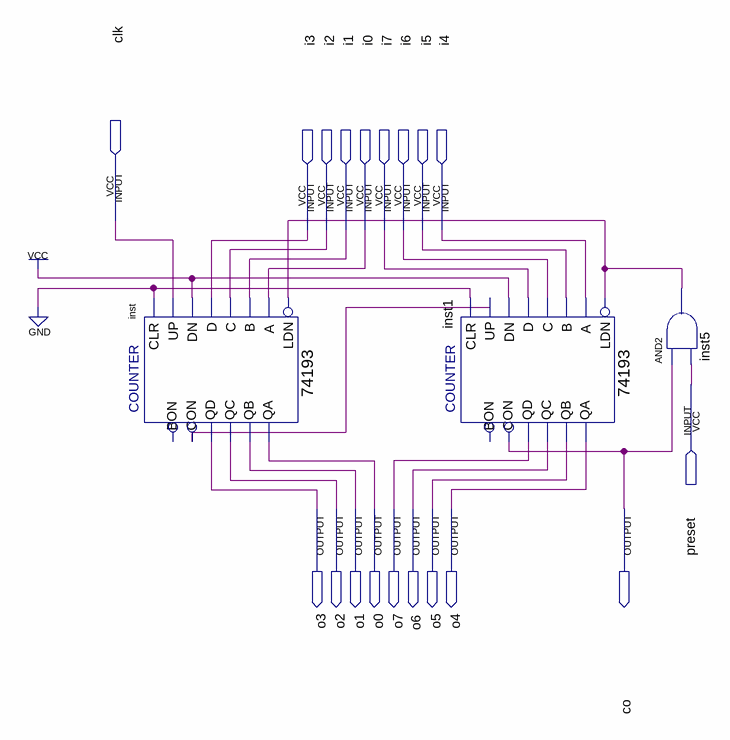
[diagram p0: schematic sheet]
// Quartus schematic frequency_divider.bdf as structural Verilog: 3 symbols, 19 pins
module frequency_divider (
  input  clk,
  input  i3,
  input  i2,
  input  i1,
  input  i0,
  input  i7,
  input  i6,
  input  i5,
  input  i4,
  input  preset,
  output o3,
  output o2,
  output o1,
  output o0,
  output o7,
  output o6,
  output o5,
  output o4,
  output co
);

  wire inst5_out, inst_con;

  \74193  inst (
    .D(i3), .C(i2), .B(i1), .A(i0), .CLR(1'b0), .UP(clk), .DN(1'b1), .LDN(inst5_out), .QB(o1), .QA(o0),
    .CON(inst_con), .QD(o3), .QC(o2));  // open: BON
  \74193  inst1 (
    .D(i7), .C(i6), .B(i5), .A(i4), .CLR(1'b0), .UP(inst_con), .DN(1'b1), .LDN(inst5_out), .QB(o5), .QA(o4),
    .CON(co), .QD(o7), .QC(o6));  // open: BON
  and inst5 (inst5_out, co, preset);
endmodule
